# Altium project core_module.PrjPcb
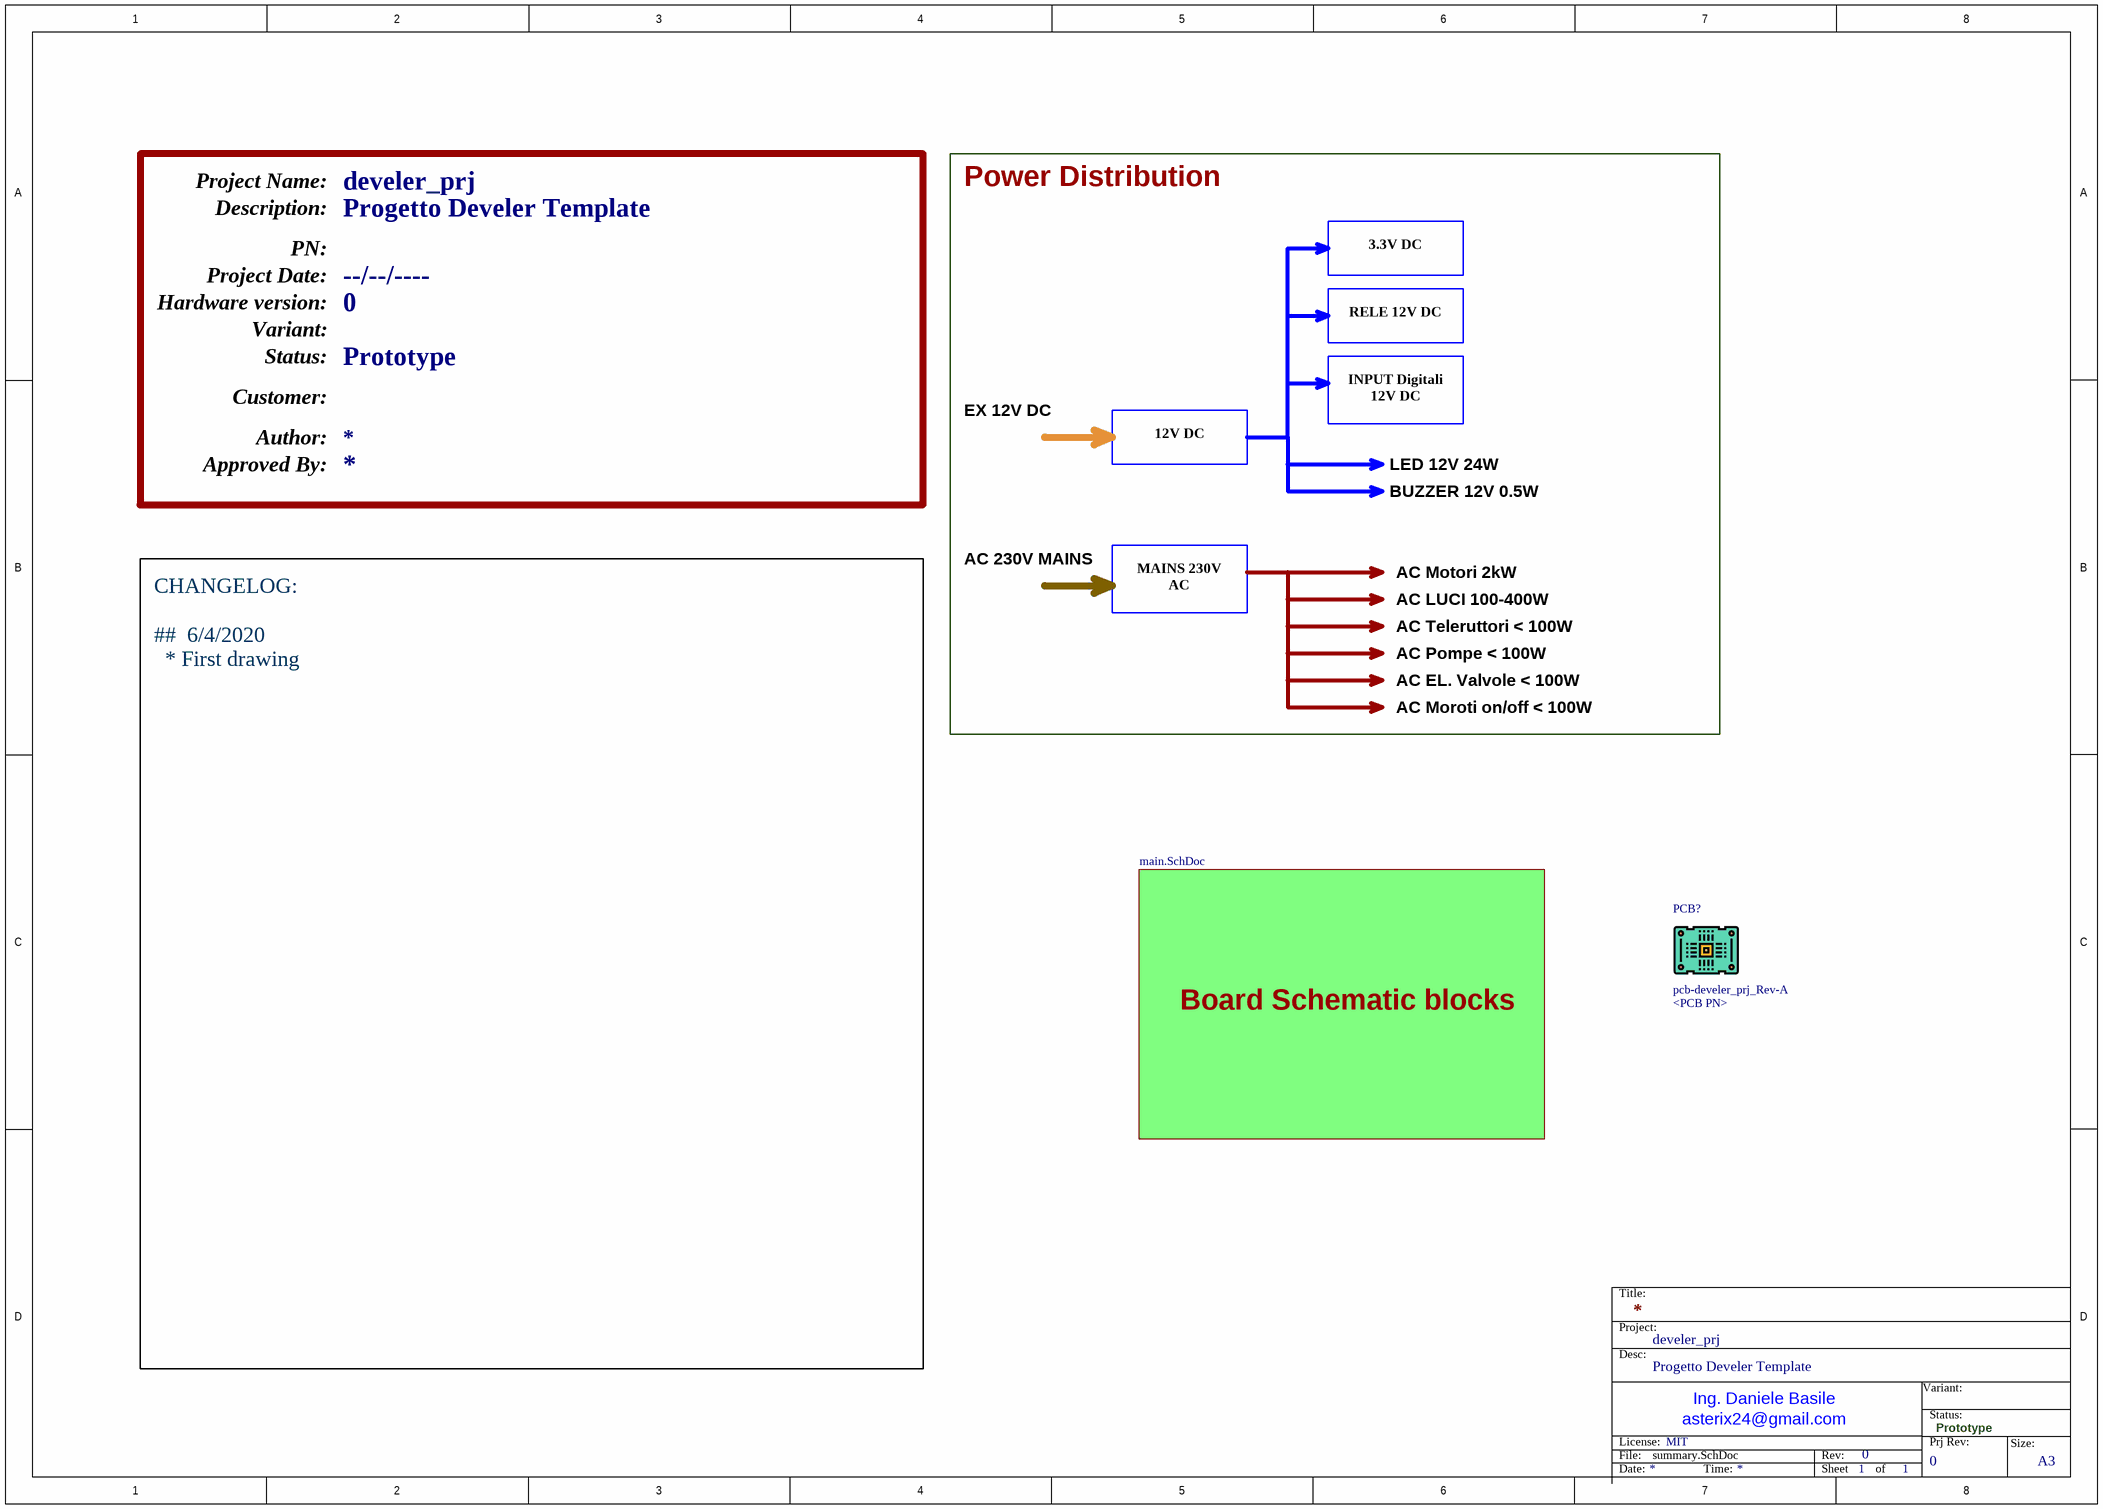
[diagram p0: summary.SchDoc]
doc_no_assy_dwg: assembly-xxxx_xxx.pdf; doc_no_bom: bom-xxx_xxx.xlsx; doc_no_fab_dwg: -; doc_no_sch_dwg: schematics-xxxx_xxx.pdf; pcb_2_dec_tol: +/-.01; pcb_3_dec_tol: +/-.010; pcb_address1: Via San Quirico 233/3; pcb_address2: 50013 Campi Bisenzio; pcb_address3: Firenze; pcb_address4: ITALIA; pcb_ang_tol: +/-1/2; pcb_checker: - -----; pcb_checker_app_date: --/--/----; pcb_designer: - -----; pcb_designer_app_date: --/--/----; pcb_dwg_no: <PCB DWG NO>; pcb_engineer: - -----; pcb_engineer_app_date: --/--/----; pcb_finish: HASL; pcb_layer_count: 2; pcb_material: FR4-Standard Tg 130-140C; pcb_organization: Develer srl; pcb_part_number: <PCB PN>; pcb_scale: 1:1; pcb_silkscreen_color: WHITE; pcb_solder_color: GREEN; pcb_stackup: Default; pcb_title1: <TITLE 1>; pcb_title2: <TITLE 2>; prj_date: --/--/----; prj_hw_ver: 0; prj_license: MIT; prj_name: develer_prj; prj_name_long: Progetto Develer Template; prj_panel_name: develer_prj_panel; prj_part_number: <PRJ PN>; prj_pcb: A; prj_status: Prototype
2 sheets, 1 parts. Net scope: global (net labels, ports and power ports of the same name join across sheets).
Board files: develer_2L_Ax_panel.PcbDoc, develer_2L_Ax.PcbDoc
Sheets:
  summary.SchDoc
     = main.SchDoc

## Sheet summary.SchDoc
size A3; Hw_rev: R1; Address3: Firenze; Address4: ITALY; Revision: 0; SheetNumber: 1; SheetTotal: 1

### Parts
PCB?  pcb-develer_prj_Rev-A  CODE Develer: <PCB PN>  (mechanical)

### Sub-sheets
? = main.SchDoc: no entries

### Notes on the sheet
- Project Name:
- Description:
- PN:
- Power Distribution
- Hardware version:
- Project Date:
- 3.3V DC
- Variant:
- Status:
- RELE 12V DC
- Author:
- Customer:
- EX 12V DC
- INPUT Digitali 12V DC
- Approved By:
- 12V DC
- LED 12V 24W
- BUZZER 12V 0.5W
- AC 230V MAINS
- AC Motori 2kW
- MAINS 230V AC
- AC LUCI 100-400W
- AC Teleruttori < 100W
- AC Pompe < 100W
- AC EL. Valvole < 100W
- AC Moroti on/off < 100W
- Board Schematic blocks
- CHANGELOG:
  ##  6/4/2020
  * First drawing
- Title:
- Project:
- Desc:
- File:
- License:
- asterix24@gmail.com
- Ing. Daniele Basile
- Rev:
- Prj Rev:
- Size:
- Date:
- Time:
- Sheet
- of
- A3

### Library data of the parts
PCB? = PCB: ='['+ pcb_part_number+'], ' + 'pcb-'+prj_name+'_Rev-'+prj_pcb + ', Betamotor'; Publisher: Develer srl; Revision: 0.1; NOTE Manufacturer PN: *; NOTE Manufacturer: *; MountTechnology: *; NOTE Description: *; NOTE Description 2: *

## Sheet main.SchDoc
size A3; Hw_rev: R1; Address3: Firenze; Address4: ITALY; Revision: 0; SheetNumber: 1; SheetTotal: 1

### Notes on the sheet
- Title:
- Project:
- Desc:
- Variant:
- File:
- License:
- asterix24@gmail.com
- Ing. Daniele Basile
- Rev:
- Prj Rev:
- Status:
- Size:
- Date:
- Time:
- Sheet
- of
- A3